# Altium schematic sheet [8] TSAL.SchDoc
size A4; DocumentNumber: 8; SheetNumber: 9; SheetTotal: 10
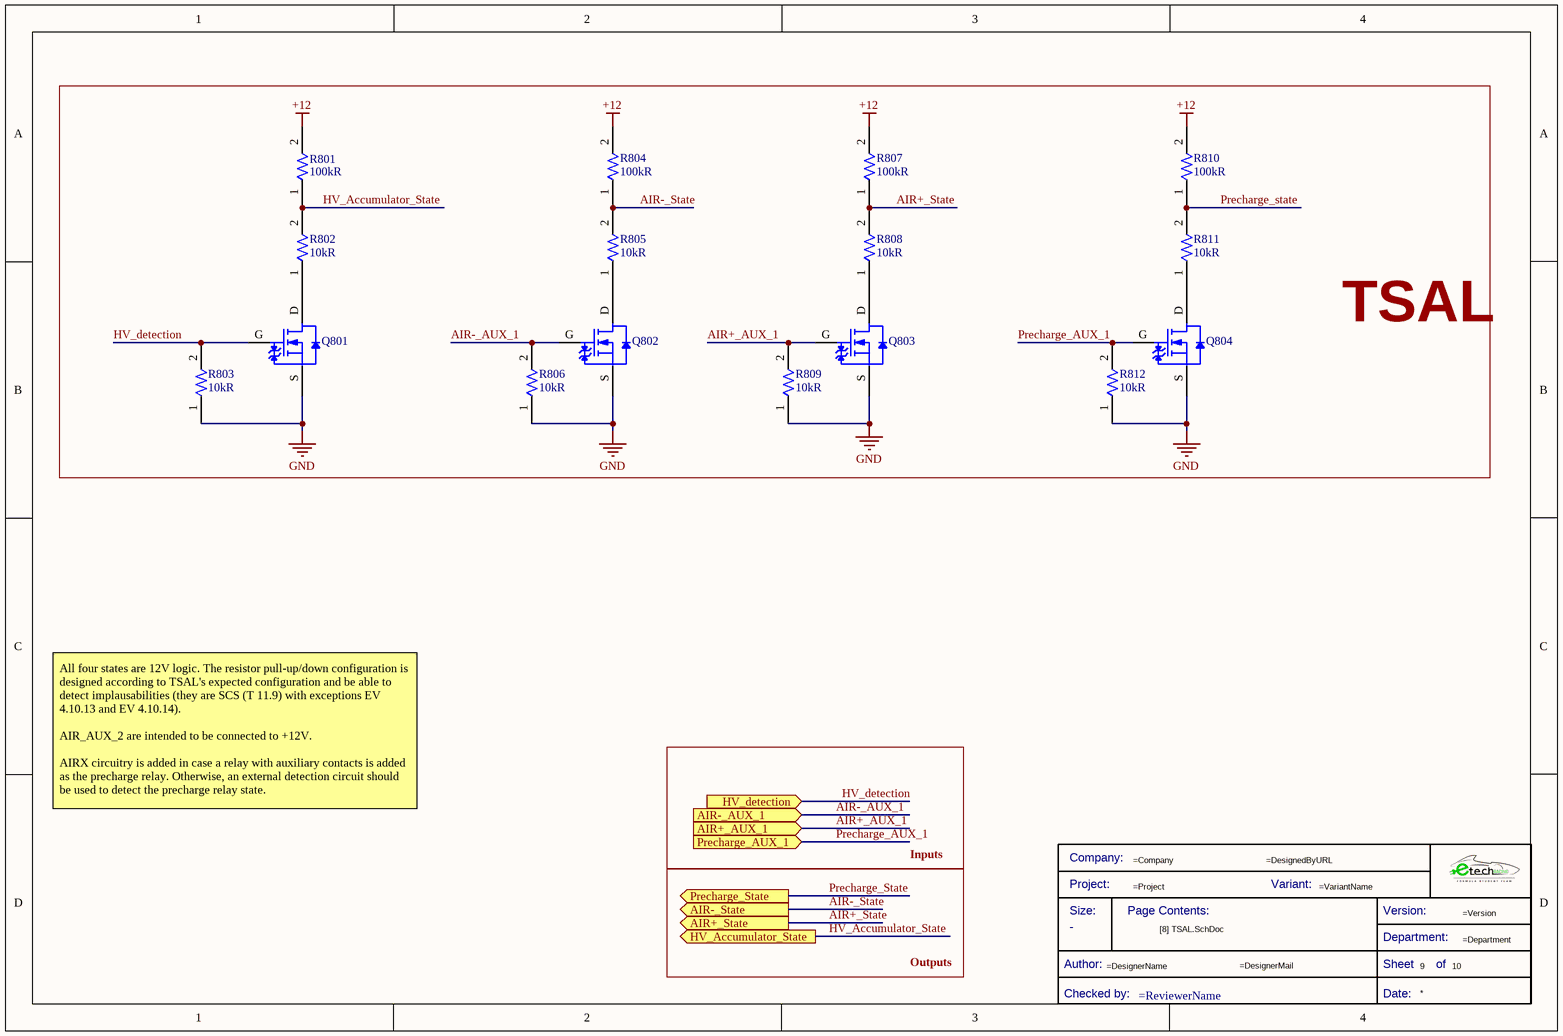
[diagram p0: [8] TSAL.SchDoc]

## Parts
*?  Title Block_template  (value not drawn)  (graphical)
Q801  CPH3455-TL-H  [TRT-NCH-3/35-CPH]  (value not drawn)
Q802  CPH3455-TL-H  [TRT-NCH-3/35-CPH]  (value not drawn)
Q803  CPH3455-TL-H  [TRT-NCH-3/35-CPH]  (value not drawn)
Q804  CPH3455-TL-H  [TRT-NCH-3/35-CPH]  (value not drawn)
R801  Resistance: 100kR  [R0805FTK]  (hidden comment: CR0805-JW-103ELF)
R802  Resistance: 10kR  [R0805FTK]  (hidden comment: CR0805-JW-103ELF)
R803  Resistance: 10kR  [R0805FTK]  (hidden comment: CR0805-JW-103ELF)
R804  Resistance: 100kR  [R0805FTK]  (hidden comment: CR0805-JW-103ELF)
R805  Resistance: 10kR  [R0805FTK]  (hidden comment: CR0805-JW-103ELF)
R806  Resistance: 10kR  [R0805FTK]  (hidden comment: CR0805-JW-103ELF)
R807  Resistance: 100kR  [R0805FTK]  (hidden comment: CR0805-JW-103ELF)
R808  Resistance: 10kR  [R0805FTK]  (hidden comment: CR0805-JW-103ELF)
R809  Resistance: 10kR  [R0805FTK]  (hidden comment: CR0805-JW-103ELF)
R810  Resistance: 100kR  [R0805FTK]  (hidden comment: CR0805-JW-103ELF)
R811  Resistance: 10kR  [R0805FTK]  (hidden comment: CR0805-JW-103ELF)
R812  Resistance: 10kR  [R0805FTK]  (hidden comment: CR0805-JW-103ELF)

## Blocks framed on the sheet
TSAL: Q801-Q804 R801-R812

## Ports
AIR+_AUX_1 (in), AIR+_State (out), AIR-_AUX_1 (in), AIR-_State (out), HV_Accumulator_State (out), HV_detection (in), Precharge_AUX_1 (in), Precharge_State (out)

## Nets
+12: R801.2 R804.2 R807.2 R810.2
GND: Q801.S Q802.S Q803.S Q804.S R803.1 R806.1 R809.1 R812.1
AIR+_AUX_1: Q803.G R809.2 ; port AIR+_AUX_1
AIR+_State: R807.1 R808.2 ; port AIR+_State
AIR-_AUX_1: Q802.G R806.2 ; port AIR-_AUX_1
AIR-_State: R804.1 R805.2 ; port AIR-_State
HV_Accumulator_State: R801.1 R802.2 ; port HV_Accumulator_State
HV_detection: Q801.G R803.2 ; port HV_detection
Precharge_AUX_1: Q804.G R812.2 ; port Precharge_AUX_1
Precharge_State: R810.1 R811.2 ; port Precharge_State
NetQ801_D: Q801.D R802.1
NetQ802_D: Q802.D R805.1
NetQ803_D: Q803.D R808.1
NetQ804_D: Q804.D R811.1

## Notes on the sheet
- All four states are 12V logic. The resistor pull-up/down configuration is designed according to TSAL's expected configuration and be able to detect implausabilities (they are SCS (T 11.9) with exceptions EV 4.10.13 and EV 4.10.14).
  AIR_AUX_2 are intended to be connected to +12V.
  AIRX circuitry is added in case a relay with auxiliary contacts is added as the precharge relay. Otherwise, an external detection circuit should be used to detect the precharge relay state.
- Inputs
- Outputs
- (in symbol Title Block_template) Company:; Project:; Variant:; Size:; Page Contents:; Version:; Department:; Author:; Sheet; of; Checked by:; Date:

## Library data of the parts
*? = Title Block_template: Standard Title Block; Category: Title Block; Checked by:: =ReviewerName; Size: -
Q801-Q804 = TRT-NCH-3/35-CPH: CPH3455-TL-H N-channel MOSFET Transistor; 3 A; 35 V; 3-Pin CPH; Manufacturer: ON Semiconductor; Rds On Max: 104mR; Input Capacitance: 186pF; Rise Time: 4.7ns; Drain to Source Voltage (Vdss): 35V; Continuous Drain Current (ID): 3A; Max Power Dissipation: 1W; Drain to Source Resistance: 108mR; Turn-On Delay Time: 4.2ns; Turn-Off Delay Time: 15ns; Fall Time: 5.7ns; Element Configuration: Single; Gate to Source Voltage (Vgs): 20V; .Creator: GP; Category: Transistor; ComponentLink1Description: Datasheet; ComponentLink1URL: https://docs.rs-online.com/5847/0900766b812d514d.pdf; ComponentLink2Description: Where buy it; ComponentLink2URL: https://es.rs-online.com/web/p/mosfet/8009989; Supplier 1: RSComponents; Manufacturer Part Number: CPH3455-TL-H; RoHS: Yes; Stock 1: 1; Pricing 1: 50=0,50400 (USD); Case/Package: SC; Number of Pins: 3; Min Operating Temperature: -55°C; Max Operating Temperature: 150°C; Package Quantity: 3000; Packaging: Tape and Reel; Drain to Source Breakdown Voltage: 35V; Power Dissipation: 1W; Polarity: N-CHANNEL; Series: -; Length: 2.9mm; Width: 1.6mm; Height: 0.9mm; Lead Free: Lead Free; Halogen Free: Halogen Free; RoHS Compliant: Yes; ComponentLink3URL: https://datasheet.ciiva.com/947/cph3455-d-947201.pdf?src-supplier=Digi-Key; ComponentLink3Description: https://datasheet.ciiva.com/947/cph3455-d-947201.pdf?src-supplier=Digi-Key; ComponentLink4URL: https://datasheet.ciiva.com/4444/cph3455-d-91653-4444616.pdf?src-supplier=Mouser; ComponentLink4Description: https://datasheet.ciiva.com/4444/cph3455-d-91653-4444616.pdf?src-supplier=Mouser; ComponentLink5URL: https://datasheet.ciiva.com/11164/cph3455-d-11164889.pdf?src-supplier=Avnet; ComponentLink5Description: https://datasheet.ciiva.com/11164/cph3455-d-11164889.pdf?src-supplier=Avnet; Supplier Part Number 1: 8009989
R801-R812 = R10k-0805FTK: BOURNS         CR0805-JW-103ELF            Surface Mount Chip Resistor, Thick Film, CR Series, 10 kohm, 125 mW,  5%, 150 V; Temperature Coefficient: 200ppm/°C; Power Rating: 125mW; Voltage Rating: 150V; Voltage Rating (DC): 100V; .Creator: DR; Supplier 1: Arrow Electronics; Manufacturer 1: Bourns; Manufacturer Part Number 1: CR0805-JW-103ELF; RoHS: Yes; Category: Chip SMD Resistors; Stock 1: 57566; Pricing 1: 1=0,05790, 10=0,01540, 25=0,01340, 100=0,00340 (USD); Mount: Surface Mount; Case/Package: 0805; Number of Pins: 2; Contact Plating: Tin; Case Code (Metric): 2012; Case Code (Imperial): 0805; Min Operating Temperature: -55°C; Max Operating Temperature: 155°C; Tolerance: 5%; Resistor Type: Thick Film; Package Quantity: 1; Packaging: Tape and Reel; Number of Terminations: 2; Termination: SMD/SMT; Max Power Dissipation: 125mW; Features: Moisture Resistant; Series: CR0805; Construction: Rectangular; Resistance Tolerance: 5%; Technology: THICK FILM; Length: 2mm; Width: 1.25mm; Height: 0.5mm; Depth: 1.25mm; Thickness: 508um; Radiation Hardening: No; REACH SVHC: No SVHC; Military Standard: Not; RoHS Compliant: Yes; ComponentLink1URL: https://datasheet.ciiva.com/11821/0900766b80fcdb72-11821135.pdf?src-supplier=RSComponents; ComponentLink1Description: https://datasheet.ciiva.com/11821/0900766b80fcdb72-11821135.pdf?src-supplier=RSComponents; ComponentLink2URL: https://datasheet.ciiva.com/9122/chpreztr-9122374.pdf?src-supplier=Avnet; ComponentLink2Description: https://datasheet.ciiva.com/9122/chpreztr-9122374.pdf?src-supplier=Avnet; ComponentLink3URL: https://datasheet.ciiva.com/22693/1902866-22693254.pdf?src-supplier=Element14; ComponentLink3Description: https://datasheet.ciiva.com/22693/1902866-22693254.pdf?src-supplier=Element14; ComponentLink4URL: https://datasheet.ciiva.com/7986/691949-7986187.pdf?src-supplier=Element14; ComponentLink4Description: https://datasheet.ciiva.com/7986/691949-7986187.pdf?src-supplier=Element14; ComponentLink5URL: https://datasheet.ciiva.com/30065/159chpreztr-30065976.pdf?src-supplier=Onlinecomponents.com; ComponentLink5Description: https://datasheet.ciiva.com/30065/159chpreztr-30065976.pdf?src-supplier=Onlinecomponents.com; ComponentLink6URL: https://datasheet.ciiva.com/16783/70154685-16783482.pdf?src-supplier=Allied+Electronics; ComponentLink6Description: https://datasheet.ciiva.com/16783/70154685-16783482.pdf?src-supplier=Allied+Electronics; ComponentLink7URL: https://datasheet.ciiva.com/5548/chpreztr-5548491.pdf?src-supplier=Mouser; ComponentLink7Description: https://datasheet.ciiva.com/5548/chpreztr-5548491.pdf?src-supplier=Mouser; ComponentLink8URL: https://datasheet.ciiva.com/6559/chpreztr-6559900.pdf?src-supplier=Digi-Key; ComponentLink8Description: https://datasheet.ciiva.com/6559/chpreztr-6559900.pdf?src-supplier=Digi-Key; ComponentLink9URL: https://datasheet.ciiva.com/6559/chpreztr-6559901.pdf?src-supplier=Digi-Key; ComponentLink9Description: https://datasheet.ciiva.com/6559/chpreztr-6559901.pdf?src-supplier=Digi-Key; ComponentLink10URL: https://datasheet.ciiva.com/7985/1856384-7985869.pdf?src-supplier=Element14; ComponentLink10Description: https://datasheet.ciiva.com/7985/1856384-7985869.pdf?src-supplier=Element14; ComponentLink11URL: https://datasheet.ciiva.com/48692/001055517-da-01-en-smd-wid-cr0805-jw-103elf-10k-ohm-1-8w-48692118.pdf?src-supplier=Conrad; ComponentLink11Description: https://datasheet.ciiva.com/48692/001055517-da-01-en-smd-wid-cr0805-jw-103elf-10k-ohm-1-8w-48692118.pdf?src-supplier=Conrad; Supplier Part Number 1: CR0805-JW-103ELF